# Altium schematic sheet 08_power.SchDoc: =Proj_Title
size B; Address1: Giesshuebelstrasse 40; Address2: 8045 Zurich, Switzerland; SheetNumber: 8
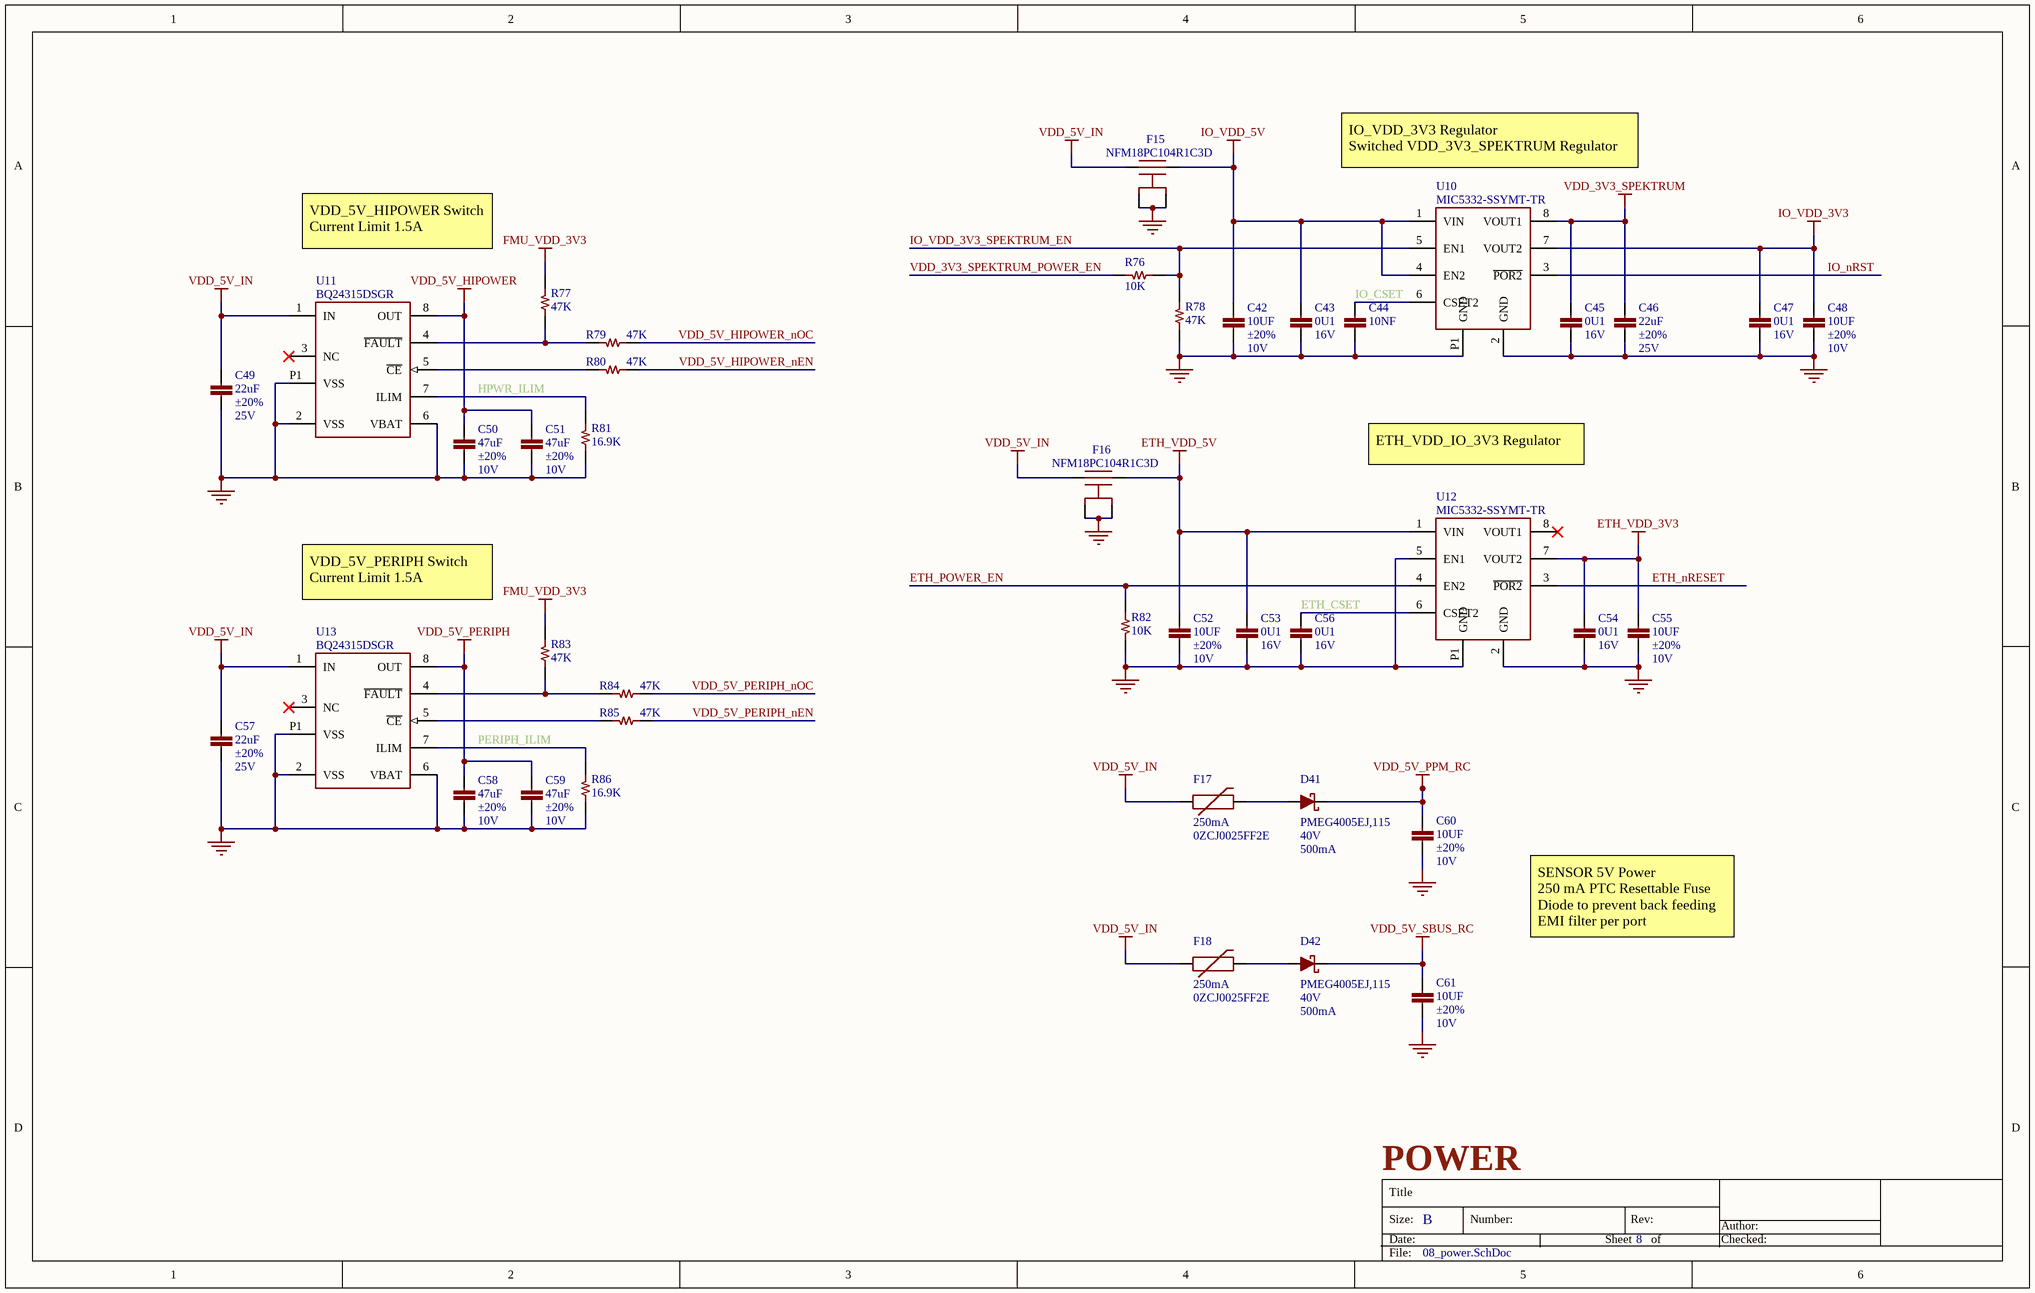
[diagram p0: 08_power.SchDoc]

## Parts
C42  value 10UF  Tolerance: ±20%  Voltage - Rated: 10V  [CAPC100X50X56L25N]  (hidden comment: CAP CER 10UF 20% 10V X5R 0402)
C43  value 0U1  Voltage - Rated: 16V  [CAPC100X50X56L25N]  (hidden comment: CAP CER 0.1UF 10% 16V X7R 0402)
C44  value 10NF  [CAPC100X50X56L25N]  (hidden comment: CAP CER 10NF 10% 50V X7R 0402)
C45  value 0U1  Voltage - Rated: 16V  [CAPC100X50X56L25N]  (hidden comment: CAP CER 0.1UF 10% 16V X7R 0402)
C46  value 22uF  Tolerance: ±20%  Voltage - Rated: 25V  [CAPC200X125X70L40N]  (hidden comment: CAP CER 22UF 20% 25V X5R 0805)
C47  value 0U1  Voltage - Rated: 16V  [CAPC100X50X56L25N]  (hidden comment: CAP CER 0.1UF 10% 16V X7R 0402)
C48  value 10UF  Tolerance: ±20%  Voltage - Rated: 10V  [CAPC100X50X56L25N]  (hidden comment: CAP CER 10UF 20% 10V X5R 0402)
C49  value 22uF  Tolerance: ±20%  Voltage - Rated: 25V  [CAPC200X125X70L40N]  (hidden comment: CAP CER 22UF 20% 25V X5R 0805)
C50  value 47uF  Tolerance: ±20%  Voltage - Rated: 10V  [CAPC200X125X145L45N]  (hidden comment: CAP CER 47UF 20% 10V X5R 0805)
C51  value 47uF  Tolerance: ±20%  Voltage - Rated: 10V  [CAPC200X125X145L45N]  (hidden comment: CAP CER 47UF 20% 10V X5R 0805)
C52  value 10UF  Tolerance: ±20%  Voltage - Rated: 10V  [CAPC100X50X56L25N]  (hidden comment: CAP CER 10UF 20% 10V X5R 0402)
C53  value 0U1  Voltage - Rated: 16V  [CAPC100X50X56L25N]  (hidden comment: CAP CER 0.1UF 10% 16V X7R 0402)
C54  value 0U1  Voltage - Rated: 16V  [CAPC100X50X56L25N]  (hidden comment: CAP CER 0.1UF 10% 16V X7R 0402)
C55  value 10UF  Tolerance: ±20%  Voltage - Rated: 10V  [CAPC100X50X56L25N]  (hidden comment: CAP CER 10UF 20% 10V X5R 0402)
C56  value 0U1  Voltage - Rated: 16V  [CAPC100X50X56L25N]  (hidden comment: CAP CER 0.1UF 10% 16V X7R 0402)
C57  value 22uF  Tolerance: ±20%  Voltage - Rated: 25V  [CAPC200X125X70L40N]  (hidden comment: CAP CER 22UF 20% 25V X5R 0805)
C58  value 47uF  Tolerance: ±20%  Voltage - Rated: 10V  [CAPC200X125X145L45N]  (hidden comment: CAP CER 47UF 20% 10V X5R 0805)
C59  value 47uF  Tolerance: ±20%  Voltage - Rated: 10V  [CAPC200X125X145L45N]  (hidden comment: CAP CER 47UF 20% 10V X5R 0805)
C60  value 10UF  Tolerance: ±20%  Voltage - Rated: 10V  [CAPC100X50X56L25N]  (hidden comment: CAP CER 10UF 20% 10V X5R 0402)
C61  value 10UF  Tolerance: ±20%  Voltage - Rated: 10V  [CAPC100X50X56L25N]  (hidden comment: CAP CER 10UF 20% 10V X5R 0402)
D41  Manufacturer Part Number: PMEG4005EJ,115  Voltage: 40V  Current: 500mA  [SODFL2512X80L40X35N]  (hidden comment: DIODE SCHOTTKY 40V 500MA SOD323F)
D42  Manufacturer Part Number: PMEG4005EJ,115  Voltage: 40V  Current: 500mA  [SODFL2512X80L40X35N]  (hidden comment: DIODE SCHOTTKY 40V 500MA SOD323F)
F15  Manufacturer Part Number: NFM18PC104R1C3D  [NFM18PC104R1C3_0603_NO_VIA]  (hidden comment: FILTER CAP FEEDTHRU 0.1UF 20% 16V 0603)
F16  Manufacturer Part Number: NFM18PC104R1C3D  [NFM18PC104R1C3_0603_NO_VIA]  (hidden comment: FILTER CAP FEEDTHRU 0.1UF 20% 16V 0603)
F17  Current Hold: 250mA  Manufacturer Part Number: 0ZCJ0025FF2E  [PTC-1206]  (hidden comment: FUSE PTC RESETTABLE 250MA 16V 1206)
F18  Current Hold: 250mA  Manufacturer Part Number: 0ZCJ0025FF2E  [PTC-1206]  (hidden comment: FUSE PTC RESETTABLE 250MA 16V 1206)
R76  value 10K  [RESC100X50X40L25]  (hidden comment: RES SMD 10K OHM 1% 1/16W 0402)
R77  value 47K  [RESC100X50X40L25]  (hidden comment: RES SMD 47K OHM 1% 1/16W 0402)
R78  value 47K  [RESC100X50X40L25]  (hidden comment: RES SMD 47K OHM 1% 1/16W 0402)
R79  value 47K  [RESC100X50X40L25]  (hidden comment: RES SMD 47K OHM 1% 1/16W 0402)
R80  value 47K  [RESC100X50X40L25]  (hidden comment: RES SMD 47K OHM 1% 1/16W 0402)
R81  value 16.9K  [RESC100X50X40L25]  (hidden comment: RES SMD 16.9K OHM 1% 1/16W 0402)
R82  value 10K  [RESC100X50X40L25]  (hidden comment: RES SMD 10K OHM 1% 1/16W 0402)
R83  value 47K  [RESC100X50X40L25]  (hidden comment: RES SMD 47K OHM 1% 1/16W 0402)
R84  value 47K  [RESC100X50X40L25]  (hidden comment: RES SMD 47K OHM 1% 1/16W 0402)
R85  value 47K  [RESC100X50X40L25]  (hidden comment: RES SMD 47K OHM 1% 1/16W 0402)
R86  value 16.9K  [RESC100X50X40L25]  (hidden comment: RES SMD 16.9K OHM 1% 1/16W 0402)
U10  Manufacturer Part Number: MIC5332-SSYMT-TR  [SON9P50_200X200X60L35X25T120X60N]  (hidden comment: IC REG LIN 3.3V/3.3V 8TMLF)
U11  Manufacturer Part Number: BQ24315DSGR  [SON9P50_200X200X80L30X25T160X80N]  (hidden comment: IC LI+ CHARGER FRONT END 8SON)
U12  Manufacturer Part Number: MIC5332-SSYMT-TR  [SON9P50_200X200X60L35X25T120X60N]  (hidden comment: IC REG LIN 3.3V/3.3V 8TMLF)
U13  Manufacturer Part Number: BQ24315DSGR  [SON9P50_200X200X80L30X25T160X80N]  (hidden comment: IC LI+ CHARGER FRONT END 8SON)

## Nets
ETH_VDD_3V3: C54.1 C55.1 U12.7(VOUT2)
ETH_VDD_5V: C52.1 C53.1 F16.3 U12.1(VIN)
FMU_VDD_3V3: R77.1 R83.1
GND: C42.2 C43.2 C44.2 C45.2 C46.2 C47.2 C48.2 C49.2 C50.2 C51.2 C52.2 C53.2 C54.2 C55.2 C56.2 C57.2 C58.2 C59.2 C60.2 C61.2 F15.2A(GND) F15.2B(GND) F16.2A(GND) F16.2B(GND) R78.2 R81.2 R82.1 R86.2 U10.2(GND) U10.P1(GND) U11.2(VSS) U11.6(VBAT) U11.P1(VSS) U12.2(GND) U12.5(EN1) U12.P1(GND) U13.2(VSS) U13.6(VBAT) U13.P1(VSS)
IO_VDD_3V3: C47.1 C48.1 U10.7(VOUT2)
IO_VDD_5V: C42.1 C43.1 F15.3 U10.1(VIN) U10.4(EN2)
VDD_3V3_SPEKTRUM: C45.1 C46.1 U10.8(VOUT1)
VDD_5V_HIPOWER: C50.1 C51.1 U11.8(OUT)
VDD_5V_IN: C49.1 C57.1 F15.1 F16.1 F17.1 F18.1 U11.1(IN) U13.1(IN)
VDD_5V_PERIPH: C58.1 C59.1 U13.8(OUT)
VDD_5V_PPM_RC: C60.1 D41.C
VDD_5V_SBUS_RC: C61.1 D42.C
ETH_CSET: C56.1 U12.6(CSET2)
ETH_nRESET: U12.3(~{POR2})
ETH_POWER_EN: R82.2 U12.4(EN2)
HPWR_ILIM: R81.1 U11.7(ILIM)
IO_CSET: C44.1 U10.6(CSET2)
IO_nRST: U10.3(~{POR2})
IO_VDD_3V3_SPEKTRUM_EN: R76.2 R78.1 U10.5(EN1)
PERIPH_ILIM: R86.1 U13.7(ILIM)
VDD_3V3_SPEKTRUM_POWER_EN: R76.1
VDD_5V_HIPOWER_nEN: R80.2
VDD_5V_HIPOWER_nOC: R79.2
VDD_5V_PERIPH_nEN: R85.2
VDD_5V_PERIPH_nOC: R84.2
NetD41_A: D41.A F17.2
NetD42_A: D42.A F18.2
NetR77_2: R77.2 R79.1 U11.4(~{FAULT})
NetR80_1: R80.1 U11.5(~{CE})
NetR83_2: R83.2 R84.1 U13.4(~{FAULT})
NetR85_1: R85.1 U13.5(~{CE})

Not connected (* = marked no-connect by the designer): U11 3(NC)*; U12 8(VOUT1)*; U13 3(NC)*

## Notes on the sheet
- IO_VDD_3V3 Regulator
  Switched VDD_3V3_SPEKTRUM Regulator
- VDD_5V_HIPOWER Switch
  Current Limit 1.5A
- ETH_VDD_IO_3V3 Regulator
- VDD_5V_PERIPH Switch
  Current Limit 1.5A
- SENSOR 5V Power
  250 mA PTC Resettable Fuse
  Diode to prevent back feeding
  EMI filter per port
- POWER
- Title
- Size:
- Date:
- B
- Number:
- Sheet
- Rev:
- of
- Author:
- Checked:
- File:

## Library data of the parts
C42 C48 C52 C55 C60 C61 = CAP_10UF_20%_10V_X5R_0402: Manufacturer: Samsung Electro-Mechanics; Manufacturer Part Number: CL05A106MP5NUNC; Packaging: Tape & Reel (TR); Part Status: Active; Temperature Coefficient: X5R; Operating Temperature: -55°C ~ 85°C; Ratings: -; Supplier 1: Digi-Key; Supplier Part Number 1: 1276-1450-1-ND; Category: Capacitors; Stock 1: 0; Pricing 1: 1=0.53, 10=0.373, 100=0.23, 500=0.1761, 1000=0.15094, 2500=0.14375, 5000=0.13656 (USD); ComponentLink1Description: https://www.digikey.com/products/en?keywords=%091276-1450-1-ND; ComponentLink1URL: https://www.digikey.com/products/en?keywords=%091276-1450-1-ND
C43 C45 C47 C53 C54 C56 = CAP_0U1_16V_X7R_0402: Manufacturer: Murata Electronics; Manufacturer Part Number: GCM155R71C104KA55J; Packaging: Cut Tape (CT); Part Status: Active; Tolerance: ±10%; Operating Temperature: -55°C ~ 125°C; Supplier 1: Digi-Key; Supplier Part Number 1: 490-7998-1-ND; Category: Capacitors; Stock 1: 6381653; Pricing 1: 1=0.1, 10=0.049, 100=0.022, 500=0.0157, 1000=0.01233, 2500=0.01121, 5000=0.01032 (USD); ComponentLink1Description: https://www.digikey.com/product-detail/en/murata-electronics/GCM155R71C104KA55J/490-7998-1-ND/4380283; ComponentLink1URL: https://www.digikey.com/product-detail/en/murata-electronics/GCM155R71C104KA55J/490-7998-1-ND/4380283
C44 = CAP_10NF_10%_50V_X7R_0402: Manufacturer: Murata Electronics North America; Manufacturer Part Number: GRM155R71H103KA88D; Voltage - Rated: 50V; Packaging: Cut Tape (CT); Part Status: Active; Tolerance: ±10%; Temperature Coefficient: X7R; Operating Temperature: -55°C ~ 125°C; Ratings: -; Supplier 1: Digi-Key; Supplier Part Number 1: 490-4516-1-ND; Category: Capacitors; Stock 1: 10174125; Pricing 1: 1=0.1, 10=0.011, 100=0.005, 500=0.00354, 1000=0.00278, 2500=0.00253, 5000=0.00233 (USD); ComponentLink1Description: https://www.digikey.com/products/en/capacitors/ceramic-capacitors/60?k=GRM155R71H103KA88D&k=&pkeyword=GRM155R71H103KA88D&pv7=2&sf=0&quantity=&ColumnSort=0&page=1&pageSize=25; ComponentLink1URL: https://www.digikey.com/products/en/capacitors/ceramic-capacitors/60?k=GRM155R71H103KA88D&k=&pkeyword=GRM155R71H103KA88D&pv7=2&sf=0&quantity=&ColumnSort=0&page=1&pageSize=25
C46 C49 C57 = CAP_22UF_20%_25V_X5R_0805: Manufacturer: Murata Electronics; Manufacturer Part Number: GRT21BR61E226ME13L; Packaging: Cut Tape (CT); Part Status: Active; Operating Temperature: -55°C ~ 125°C; Supplier 1: Digi-Key; Supplier Part Number 1: 490-12389-1-ND; Category: Capacitors; Stock 1: 0; Pricing 1: 1=0.58 (USD); ComponentLink1Description: https://www.digikey.com/en/products/detail/murata-electronics/GRT21BR61E226ME13L/5416811; ComponentLink1URL: https://www.digikey.com/en/products/detail/murata-electronics/GRT21BR61E226ME13L/5416811
C50 C51 C58 C59 = CAP_47UF_20%_10V_X5R_0805: Manufacturer: Murata Electronics North America; Manufacturer Part Number: GRM21BR61A476ME15L; Packaging: Cut Tape (CT); Part Status: Active; Operating Temperature: -55°C ~ 85°C; Supplier 1: Digi-Key; Supplier Part Number 1: 490-9961-1-ND; Category: Capacitors; Stock 1: 4315932; Pricing 1: 1=0.75 (USD); ComponentLink1Description: https://www.digikey.com/product-detail/en/murata-electronics-north-america/GRM21BR61A476ME15L/490-9961-1-ND/5026442; ComponentLink1URL: https://www.digikey.com/product-detail/en/murata-electronics-north-america/GRM21BR61A476ME15L/490-9961-1-ND/5026442
D41 D42 = DIODE_SCHOTTKY_LOW_VF_40V_500MA_SOD323F: Manufacturer: Nexperia USA Inc.; Packaging: Cut Tape (CT); Part Status: Active; ComponentLink1URL: https://www.digikey.com/products/en/discrete-semiconductor-products/diodes-rectifiers-single/280?k=PMEG4005EJ%2C115&k=&pkeyword=PMEG4005EJ%2C115&pv7=2&sf=0&quantity=&ColumnSort=0&page=1&pageSize=25; ComponentLink1Description: https://www.digikey.com/products/en/discrete-semiconductor-products/diodes-rectifiers-single/280?k=PMEG4005EJ%2C115&k=&pkeyword=PMEG4005EJ%2C115&pv7=2&sf=0&quantity=&ColumnSort=0&page=1&pageSize=25; Supplier 1: Digi-Key; Supplier Part Number 1: 1727-3877-1-ND; Category: Discrete Semiconductor Products; Stock 1: 0; Pricing 1: 1=0.5, 10=0.38, 100=0.2414, 500=0.16946, 1000=0.1335 (USD)
F15 F16 = FILTER_0.1uF_16V_2A_NO_VIA_0603: Manufacturer: Murata Electronics North America; Packaging: Cut Tape (CT); Part Status: Active; Tolerance: ±20%; Voltage - Rated: 16V; Operating Temperature: -55°C ~ 125°C; Supplier 1: Digi-Key; Supplier Part Number 1: 490-6969-1-ND; Category: Filters; Stock 1: 172860; Pricing 1: 1=0.19, 10=0.173, 25=0.1652, 50=0.1598, 100=0.1544, 250=0.1464, 500=0.12246, 1000=0.09503 (USD); ComponentLink1Description: https://www.digikey.com/products/en/filters/feed-through-capacitors/845?k=NFM18PC104R1C3D&k=&pkeyword=NFM18PC104R1C3D&pv7=2&sf=0&quantity=&ColumnSort=0&page=1&pageSize=25; ComponentLink1URL: https://www.digikey.com/products/en/filters/feed-through-capacitors/845?k=NFM18PC104R1C3D&k=&pkeyword=NFM18PC104R1C3D&pv7=2&sf=0&quantity=&ColumnSort=0&page=1&pageSize=25
F17 F18 = FUSE_PTC_250MA_SMD: Manufacturer: Bel Fuse Inc.; Type: Polymeric; Approvals: cURus, TUV; RoHS: RoHS Compliant; Packaging: Cut Tape (CT); Part Status: Active; Voltage - Max: 16V; Operating Temperature: -40°C ~ 85°C; Mounting Type: Surface Mount; Package / Case: 1206 (3216 Metric), Concave; Size / Dimension: 0.128" L x 0.065" W (3.25mm x 1.65mm); Thickness (Max): 0.047" (1.20mm); Supplier 1: Digi-Key; Supplier Part Number 1: 507-1798-1-ND; Category: Circuit Protection; Stock 1: 24334; Pricing 1: 1=0.21, 5=0.2, 10=0.191, 50=0.1706, 100=0.1588, 250=0.14112, 500=0.1176, 1000=0.11172 (USD); ComponentLink1Description: https://www.digikey.com/products/en/circuit-protection/ptc-resettable-fuses/150?k=ZCJ0025FF2E&k=&pkeyword=ZCJ0025FF2E&pv7=2&sf=0&quantity=&ColumnSort=0&page=1&pageSize=25; ComponentLink1URL: https://www.digikey.com/products/en/circuit-protection/ptc-resettable-fuses/150?k=ZCJ0025FF2E&k=&pkeyword=ZCJ0025FF2E&pv7=2&sf=0&quantity=&ColumnSort=0&page=1&pageSize=25
R76 R82 = RES_10K_1%_1/16W_0402: Manufacturer: Vishay Dale; Manufacturer Part Number: CRCW040210K0FKED; Packaging: Cut Tape (CT); Part Status: Active; Tolerance: ±1%; Operating Temperature: -55°C ~ 155°C; Supplier 1: Digi-Key; Supplier Part Number 1: 541-10.0KLCT-ND; Category: Resistors; Stock 1: 37996194; Pricing 1: 1=0.1, 10=0.014, 100=0.0056, 1000=0.00253, 2500=0.0022, 5000=0.00181 (USD); Power: 1/16W; ComponentLink1Description: https://www.digikey.com/products/en?keywords=311-10.0KLRCT-ND; ComponentLink1URL: https://www.digikey.com/products/en?keywords=311-10.0KLRCT-ND
R77-R80 R83-R85 = RES_47K_1%_1/16W_0402: Manufacturer: Yageo; Manufacturer Part Number: RC0402FR-0747KL; Packaging: Cut Tape (CT); Part Status: Active; Tolerance: ±1%; Operating Temperature: -55°C ~ 155°C; Supplier 1: Digi-Key; Supplier Part Number 1: 311-47.0KLRCT-ND; Category: Resistors; Stock 1: 959925; Pricing 1: 1=0.1, 10=0.014, 100=0.0056, 1000=0.00253, 2500=0.0022, 5000=0.00181 (USD); Power: 1/16W; ComponentLink1Description: https://www.digikey.com/product-detail/en/vishay-dale/CRCW040247K0FKEDC/541-3966-1-ND/7928649; ComponentLink1URL: https://www.digikey.com/product-detail/en/vishay-dale/CRCW040247K0FKEDC/541-3966-1-ND/7928649
R81 R86 = RES_16.9K_1%_1/16W_0402: Manufacturer: Yageo; Manufacturer Part Number: RC0402FR-0716K9L; Packaging: Cut Tape (CT); Part Status: Active; Tolerance: ±1%; Operating Temperature: -55°C ~ 155°C; Supplier 1: Digi-Key; Supplier Part Number 1: YAG3003CT-ND; Category: Resistors; Stock 1: 8493470; Pricing 1: 1=0.1, 10=0.014, 100=0.0056, 1000=0.00253, 2500=0.0022, 5000=0.00181 (USD); Power: 1/16W; ComponentLink1Description: https://www.digikey.com/product-detail/en/yageo/RC0402FR-0716K9L/YAG3003CT-ND/5281868; ComponentLink1URL: https://www.digikey.com/product-detail/en/yageo/RC0402FR-0716K9L/YAG3003CT-ND/5281868
U10 U12 = IC_MIC5332-SSYMT-TR: Manufacturer: Microchip Technology; Packaging: Cut Tape (CT); Part Status: Active; Operating Temperature: -40°C ~ 125°C; Supplier 1: Digi-Key; Supplier Part Number 1: 576-4110-1-ND; Category: Integrated Circuits (ICs); Stock 1: 9000; Pricing 1: 1=1, 25=0.8296, 100=0.756 (USD); ComponentLink2Description: https://www.digikey.com/product-detail/en/microchip-technology/MIC5332-SSYMT-TR/576-4110-1-ND/3671745; ComponentLink2URL: https://www.digikey.com/product-detail/en/microchip-technology/MIC5332-SSYMT-TR/576-4110-1-ND/3671745
U11 U13 = IC_BQ24315DSGT_8WSON: Manufacturer: Texas Instruments; Packaging: Cut Tape (CT); Part Status: Active; Operating Temperature: -40°C ~ 125°C (TJ); ComponentLink1URL: https://www.digikey.com/product-detail/en/texas-instruments/BQ24315DSGR/296-23341-1-ND/1833318; ComponentLink1Description: https://www.digikey.com/product-detail/en/texas-instruments/BQ24315DSGR/296-23341-1-ND/1833318; Supplier 1: Digi-Key; Supplier Part Number 1: 296-23341-1-ND; Category: Integrated Circuits (ICs); Stock 1: 9524; Pricing 1: 1=1.05, 10=0.936, 100=0.7297, 500=0.60276, 1000=0.47586 (USD)